# Altium project PCB_Project1.PrjPCB
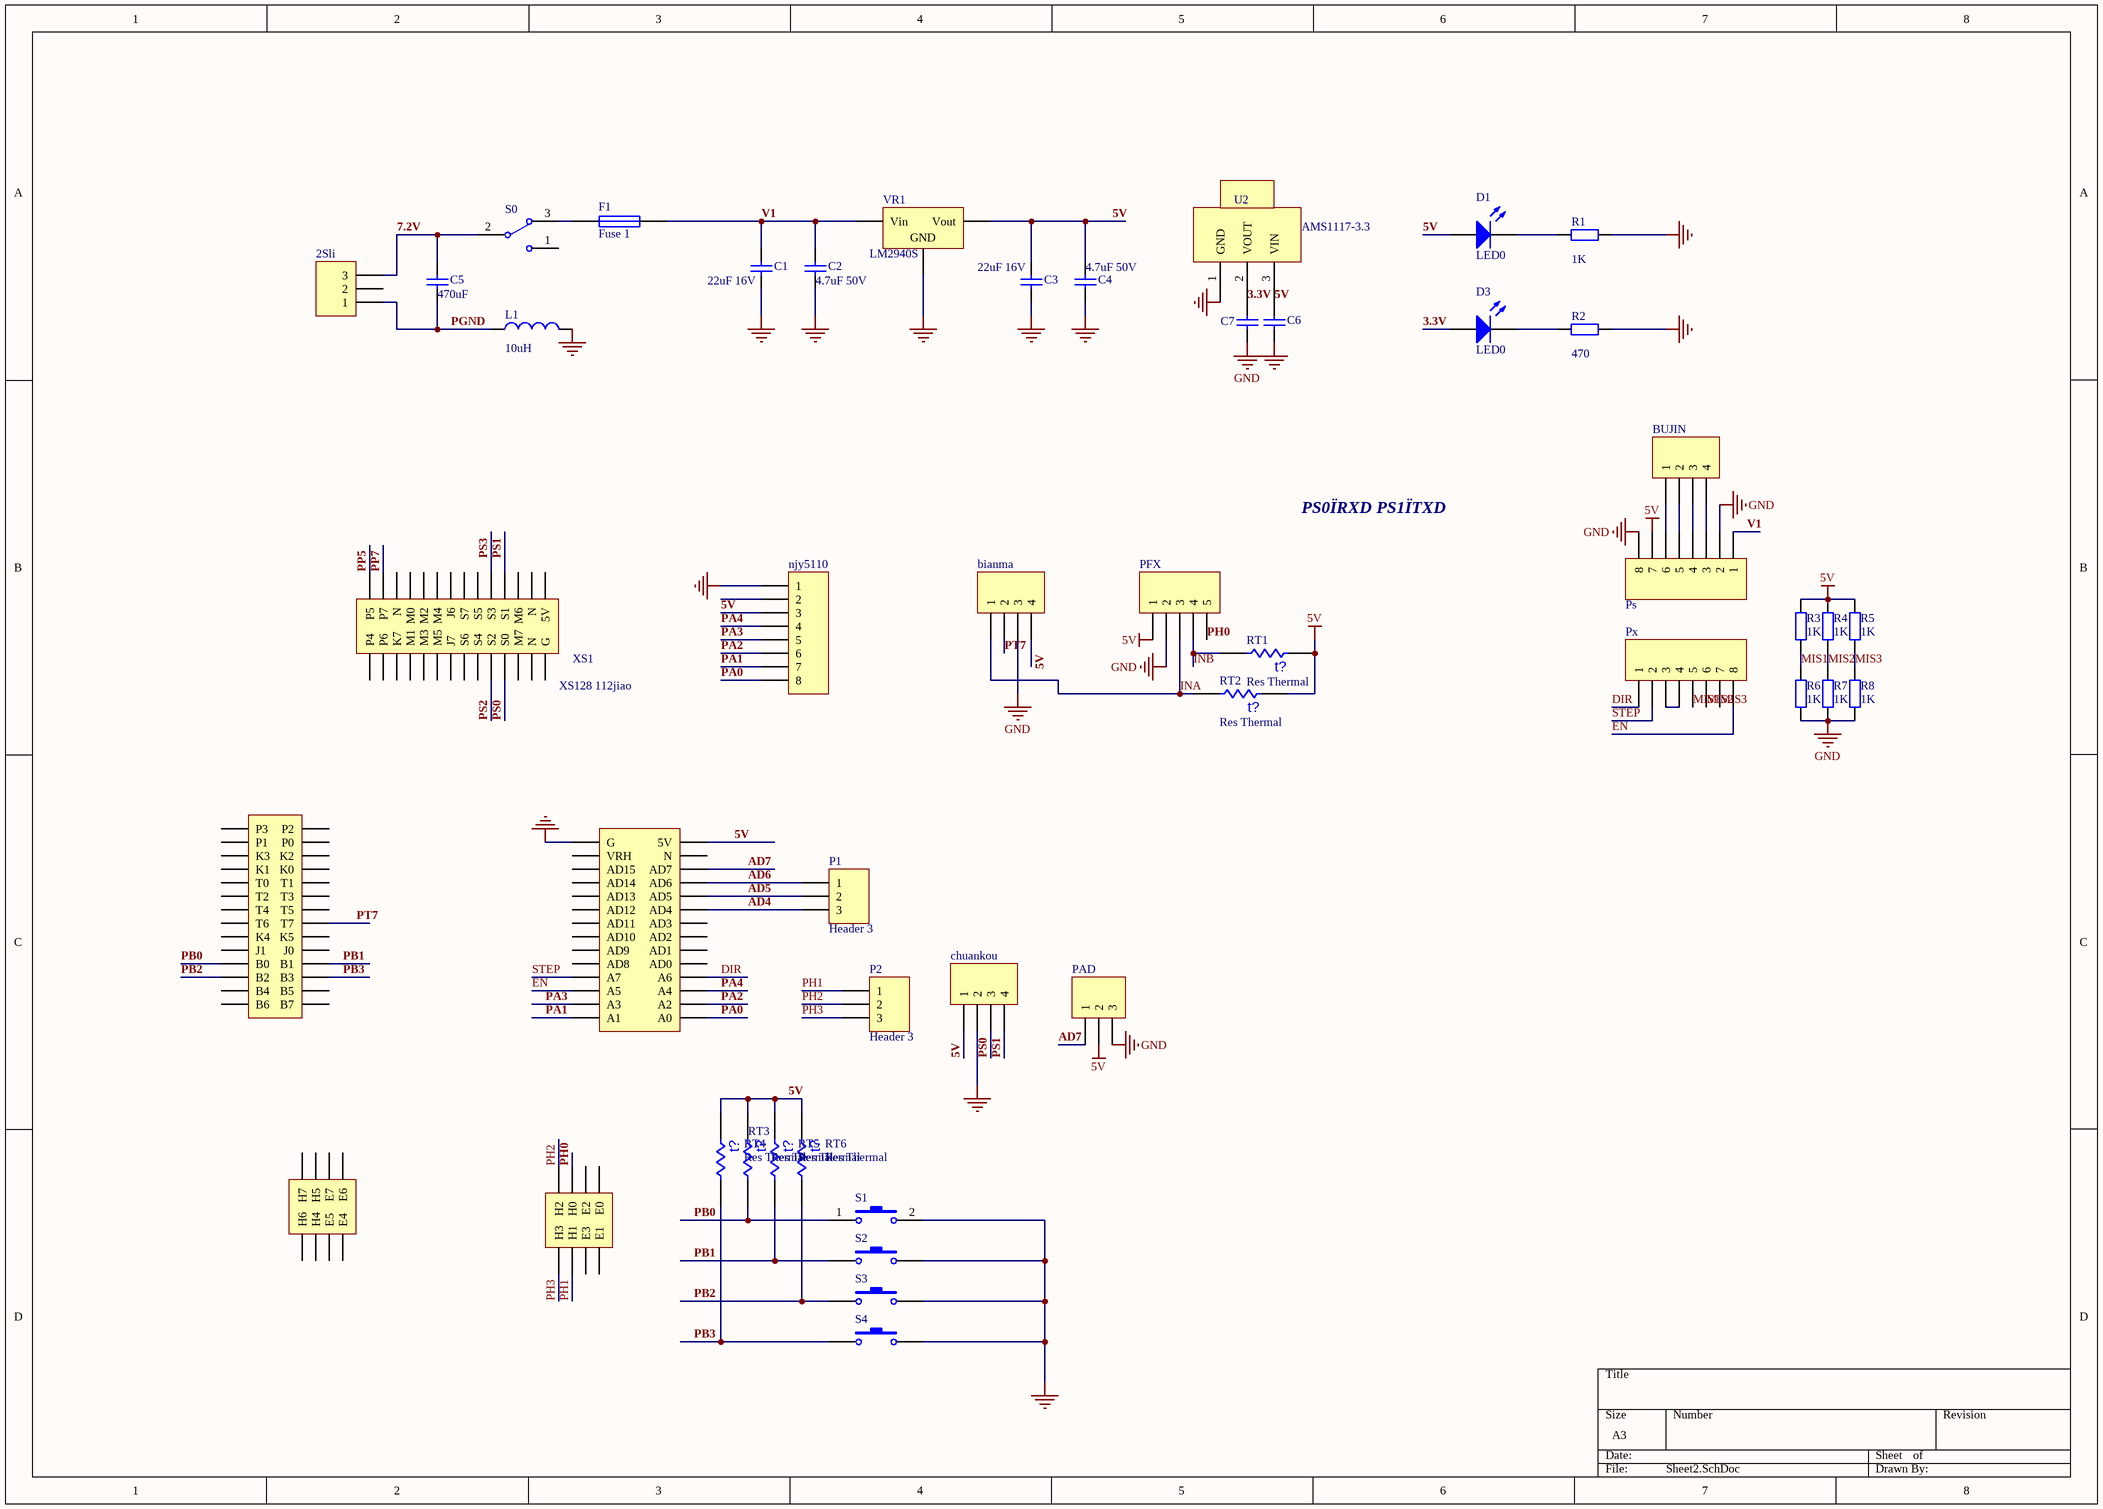
[diagram p0: Sheet2.SchDoc]
1 sheet, 44 parts. Net scope: global (net labels, ports and power ports of the same name join across sheets).
Board file: PCB1.PcbDoc

## Sheet Sheet2.SchDoc
size A3

### Parts
2Sli  Header 3  [HDR1X3]  (value not drawn)
bianma  Header 4  [HDR1X4]  (value not drawn)
BUJIN  Header 4  [HDR1X4]  (value not drawn)
C1  value 22uF 16V  [C1206]  (hidden comment: Cap)
C2  value 4.7uF 50V  [C0805]  (hidden comment: Cap)
C3  value 22uF 16V  [C0805]  (hidden comment: Cap)
C4  value 4.7uF 50V  [C1206]  (hidden comment: Cap)
C5  value 470uF  [C3]  (hidden comment: Cap)
C6  Cap  [C0805]  (value not drawn)
C7  Cap  [C0805]  (value not drawn)
chuankou  Header 4  [HDR1X4]  (value not drawn)
D1  LED0  [C0805]
D3  LED0  [C0805]
F1  Fuse 1  [FUSE]
L1  value 10uH  [L]  (hidden comment: Inductor)
njy5110  Header 8  [HDR1X8]  (value not drawn)
P1  Header 3  [HDR1X3]
P2  Header 3  [HDR1X3]
PAD  Header 3  [HDR1X3]  (value not drawn)
PFX  Header 5  [HDR1X5]  (value not drawn)
Ps  Header 8  [HDR1X8]  (value not drawn)
Px  Header 8  [HDR1X8]  (value not drawn)
R1  value 1K  [C0805]  (hidden comment: Res2)
R2  value 470  [C0805]  (hidden comment: Res2)
R3  value 1K  [C0805]  (hidden comment: Res2)
R4  value 1K  [C0805]  (hidden comment: Res2)
R5  value 1K  [C0805]  (hidden comment: Res2)
R6  value 1K  [C0805]  (hidden comment: Res2)
R7  value 1K  [C0805]  (hidden comment: Res2)
R8  value 1K  [C0805]  (hidden comment: Res2)
RT1  Res Thermal  [6-0805]
RT2  Res Thermal  [6-0805]
RT3  Res Thermal  [6-0805]
RT4  Res Thermal  [6-0805]
RT5  Res Thermal  [6-0805]
RT6  Res Thermal  [6-0805]
S0  SW-SPDT  [S4]  (value not drawn)
S1  SW-PB  [S5]  (value not drawn)
S2  SW-PB  [S5]  (value not drawn)
S3  SW-PB  [S5]  (value not drawn)
S4  SW-PB  [S5]  (value not drawn)
U2  AMS1117-3.3  [SOT223]
VR1  LM2940S  [LM2940]
XS1  XS128 112jiao  [XS128接口]

### Nets
5V: bianma.4 C3.2 C4.2 C6.1 chuankou.1 D1.1(A) njy5110.3 PAD.2 PFX.1 Ps.7 R3.2 R4.2 R5.2 RT1.1 RT2.1 RT3.1 RT4.1 RT5.1 RT6.1 U2.3(VIN) VR1.3(Vout) XS1.327(5V)
GND: bianma.3 C1.1 C2.1 C3.1 C4.1 C6.2 C7.1 chuankou.2 L1.2 njy5110.1 PAD.3 PFX.2 Ps.2 Ps.8 R1.2 R2.2 R6.1 R7.1 R8.1 S1.2 S2.2 S3.2 S4.2 U2.1(GND) VR1.2(GND) XS1.328(G)
3.3V: C7.2 D3.1(A) U2.2(VOUT)
7.2V: 2Sli.3 C5.2 S0.2
AD4: P1.3 XS1.317(AD4)
AD5: P1.2 XS1.319(AD5)
AD6: P1.1 XS1.321(AD6)
AD7: PAD.1 XS1.323(AD7)
DIR: Px.1 XS1.307(A6)
EN: Px.8 XS1.306(A5)
INA: bianma.1 PFX.3 RT2.2
INB: PFX.4 RT1.2
MIS1: Px.5 R3.1 R6.2
MIS2: Px.6 R4.1 R7.2
MIS3: Px.7 R5.1 R8.2
PA0: njy5110.8 XS1.301(A0)
PA1: njy5110.7 XS1.302(A1)
PA2: njy5110.6 XS1.303(A2)
PA3: njy5110.5 XS1.304(A3)
PA4: njy5110.4 XS1.305(A4)
PB0: RT3.2 S1.1 XS1.121(B0)
PB1: RT5.2 S2.1 XS1.122(B1)
PB2: RT6.2 S3.1 XS1.123(B2)
PB3: RT4.2 S4.1 XS1.124(B3)
PGND: 2Sli.1 C5.1 L1.1
PH0: PFX.5 XS1.504(H0)
PH1: P2.1 XS1.503(H1)
PH2: P2.2 XS1.502(H2)
PH3: P2.3 XS1.501(H3)
PP5: XS1.227(P5)
PP7: XS1.225(P7)
PS0: chuankou.3 XS1.208(S0)
PS1: chuankou.4 XS1.207(S1)
PS2: XS1.210(S2)
PS3: XS1.209(S3)
PT7: bianma.2 XS1.116(T7)
STEP: Px.2 XS1.308(A7)
V1: C1.2 C2.2 F1.2 Ps.1 VR1.1(Vin)
NetBUJIN_1: BUJIN.1 Ps.6
NetBUJIN_2: BUJIN.2 Ps.5
NetBUJIN_3: BUJIN.3 Ps.4
NetBUJIN_4: BUJIN.4 Ps.3
NetD1_2: D1.2(K) R1.1
NetD3_2: D3.2(K) R2.1
NetF1_1: F1.1 S0.3
NetPx_3: Px.3 Px.4

Not connected (* = marked no-connect by the designer): 2Sli 2; njy5110 2; S0 1; XS1 101(P3) 102(P2) 103(P1) 104(P0) 105(K3) 106(K2) 107(K1) 108(K0) 109(T0) 110(T1) 111(T2) 112(T3) 113(T4) 114(T5) 115(T6) 117(K4) 118(K5) 119(J1) 120(J0) 125(B4) 126(B5) 127(B6) 128(B7) 201(5V) 202(G) 203(N) 204(N) 205(M6) 206(M7) 211(S5) 212(S4) 213(S7) 214(S6) 215(J6) 216(J7) 217(M4) 218(M5) 219(M2) 220(M3) 221(M0) 222(M1) 223(N) 224(K7) 226(P6) 228(P4) 309(AD0) 310(AD8) 311(AD1) 312(AD9) 313(AD2) 314(AD10) 315(AD3) 316(AD11) 318(AD12) 320(AD13) 322(AD14) 324(AD15) 325(N) 326(VRH) 401(H6) 402(H7) 403(H4) 404(H5) 405(E5) 406(E7) 407(E4) 408(E6) 505(E3) 506(E2) 507(E1) 508(E0)

### Notes on the sheet
- PS0ΪRXD PS1ΪTXD
- (in symbol Res Thermal) t?

### Library data of the parts
2Sli P1 P2 PAD = Header 3: Header, 3-Pin; LatestRevisionDate: 17-Jul-2002; LatestRevisionNote: Re-released for DXP Platform.; Publisher: Altium Limited
bianma BUJIN chuankou = Header 4: Header, 4-Pin; LatestRevisionDate: 17-Jul-2002; LatestRevisionNote: Re-released for DXP Platform.; Publisher: Altium Limited
C1-C5 = Cap: Capacitor; Published: 8-Jun-2000; LatestRevisionDate: 17-Jul-2002; LatestRevisionNote: Re-released for DXP Platform.; PackageReference: RAD-0.3; Publisher: Altium Limited
C6 C7 = Cap: Capacitor; Value: 100pF; Published: 8-Jun-2000; LatestRevisionDate: 17-Jul-2002; LatestRevisionNote: Re-released for DXP Platform.; PackageReference: RAD-0.3; Publisher: Altium Limited
D1 D3 = LED0: Typical INFRARED GaAs LED; Published: 8-Jun-2000; LatestRevisionDate: 08-Jul-2005; LatestRevisionNote: Mech Layer 1 removed.; PackageReference: LED-0; Publisher: Altium Limited
F1 = Fuse 1: 2A; Published: 8-Jun-2000; LatestRevisionDate: 17-Jul-2002; LatestRevisionNote: Re-released for DXP Platform.; PackageReference: PIN-W2/E2.8; Publisher: Altium Limited
L1 = Inductor: Code_IEC: 1005; Published: 8-Jun-2000; LatestRevisionDate: 17-Jul-2002; LatestRevisionNote: Re-released for DXP Platform.; PackageReference: 0402-A; Publisher: Altium Limited; Code_JEITA: 0402
njy5110 Ps Px = Header 8: Header, 8-Pin; LatestRevisionDate: 17-Jul-2002; LatestRevisionNote: Re-released for DXP Platform.; Publisher: Altium Limited
PFX = Header 5: Header, 5-Pin; LatestRevisionDate: 17-Jul-2002; LatestRevisionNote: Re-released for DXP Platform.; Publisher: Altium Limited
R1-R8 = Res2: Resistor; Published: 8-Jun-2000; LatestRevisionDate: 17-Jul-2002; LatestRevisionNote: Re-released for DXP Platform.; PackageReference: AXIAL-0.4; Publisher: Altium Limited
RT1-RT6 = Res Thermal: Thermistor; Published: 24-Mar-1999; LatestRevisionDate: 04-Mar-2005; LatestRevisionNote: PCB Footprint replaced.; PackageReference: 6-0805; Publisher: Altium Limited
S0 = SW-SPDT: SPDT Subminiature Toggle Switch, Right Angle Mounting, Vertical Actuation; Published: 24-Mar-1999; LatestRevisionDate: 17-Dec-2003; LatestRevisionNote: Schematic revised, PCB Footprint replaced.; DatasheetDocument: 05-Dec-2000; PackageReference: TL36WW15050; Publisher: Altium Limited; ComponentLink1Description: Manufacturer Link; ComponentLink1URL: http://www.apem.com
S1-S4 = SW-PB: Switch; Published: 24-Mar-1999; LatestRevisionDate: 17-Jul-2002; LatestRevisionNote: Re-released for DXP Platform.; PackageReference: SPST-2; Publisher: Altium Limited
VR1 = Volt Reg: Voltage Regulator; Published: 24-Mar-1999; LatestRevisionDate: 17-Jul-2002; LatestRevisionNote: Re-released for DXP Platform.; PackageReference: D2PAK; Publisher: Altium Limited; Code_JEDEC: SMD-220